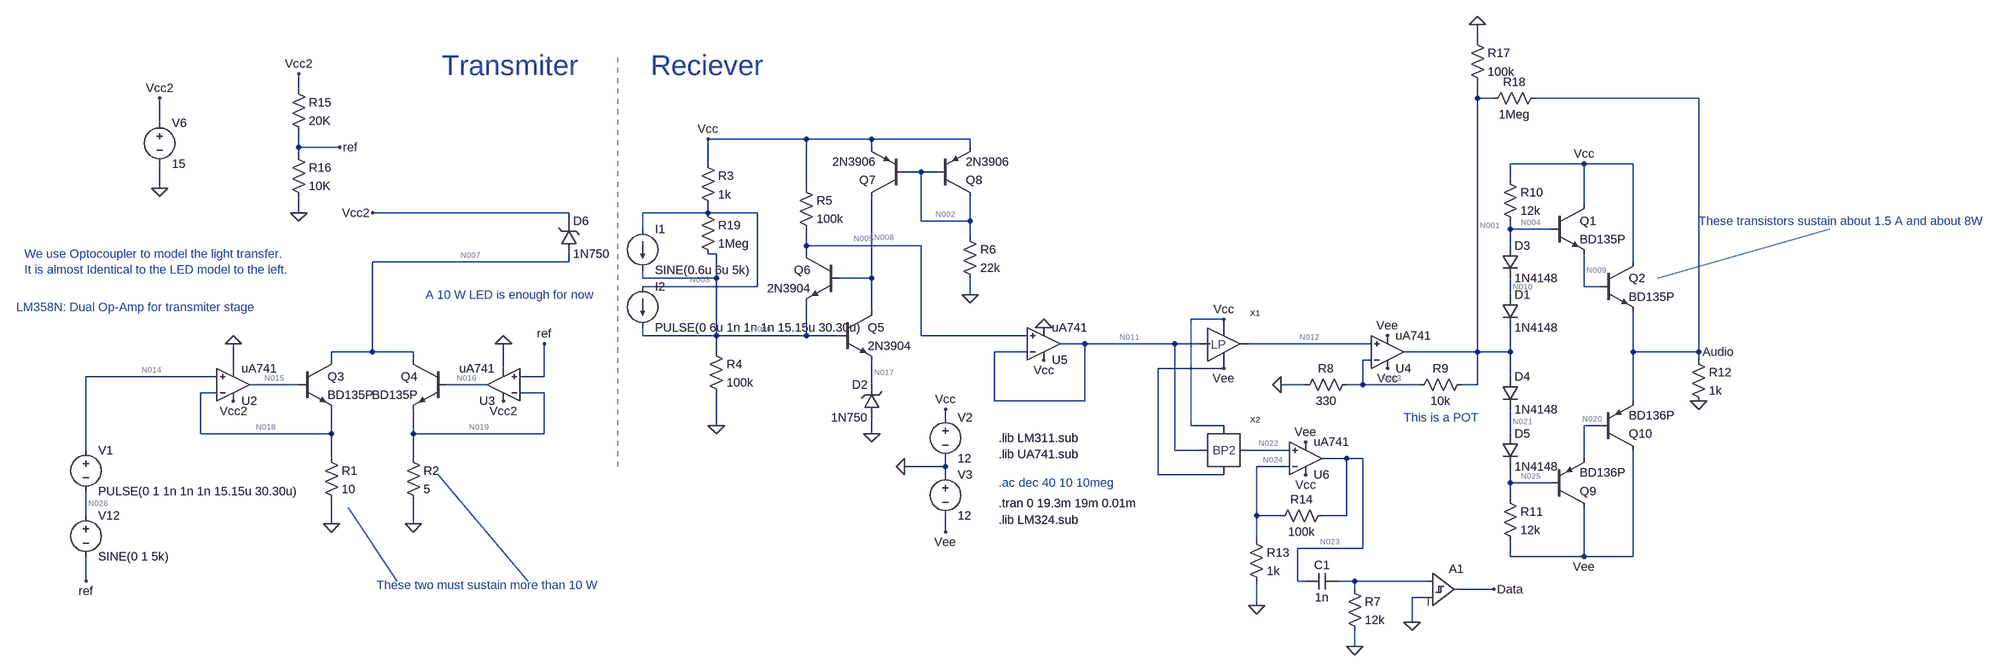
[diagram p0: schematic sim.asc]
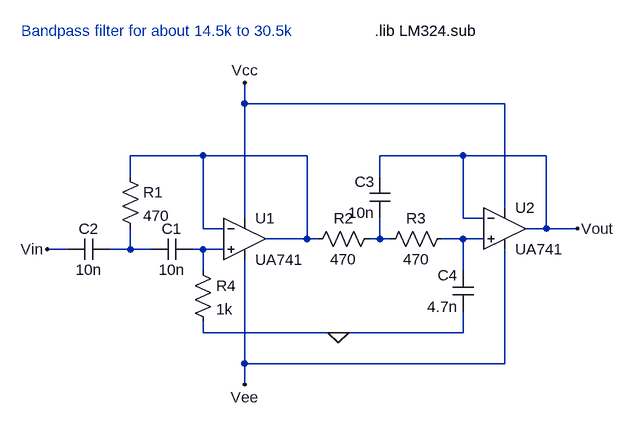
[diagram p1: sub-circuit bandpass2.asc]
sim.asc, the LTspice schematic file:
Version 4
SHEET 1 1732 1272
WIRE 208 -144 208 -176
WIRE -2096 -48 -2096 -80
WIRE 208 -32 208 -64
WIRE 240 -32 208 -32
WIRE 640 -32 320 -32
WIRE -2368 16 -2368 -32
WIRE -1104 48 -1296 48
WIRE -976 48 -1104 48
WIRE -784 48 -976 48
WIRE -2096 64 -2096 32
WIRE -2016 64 -2096 64
WIRE -976 64 -976 48
WIRE -784 64 -784 48
WIRE -2096 80 -2096 64
WIRE -1296 96 -1296 48
WIRE 416 96 272 96
WIRE 512 96 416 96
WIRE -880 112 -912 112
WIRE -848 112 -880 112
WIRE 272 128 272 96
WIRE -2368 144 -2368 96
WIRE -1104 144 -1104 48
WIRE 416 176 416 96
WIRE -2096 192 -2096 160
WIRE -1568 192 -1952 192
WIRE -1296 192 -1296 176
WIRE -1296 192 -1424 192
WIRE -1200 192 -1296 192
WIRE -1568 208 -1568 192
WIRE -880 208 -880 112
WIRE -784 208 -784 160
WIRE -784 208 -880 208
WIRE -1424 224 -1424 192
WIRE 272 224 272 208
WIRE 352 224 272 224
WIRE -784 240 -784 208
WIRE -1104 256 -1104 224
WIRE -880 256 -1104 256
WIRE 272 256 272 224
WIRE -1280 272 -1296 272
WIRE -1104 272 -1104 256
WIRE -1568 288 -1568 272
WIRE -1568 288 -1952 288
WIRE 512 288 512 96
WIRE -1424 320 -1424 304
WIRE -1280 320 -1280 272
WIRE -1280 320 -1424 320
WIRE -976 320 -976 160
WIRE -976 320 -1040 320
WIRE -1200 336 -1200 192
WIRE -1200 336 -1424 336
WIRE 416 336 416 272
WIRE 448 336 416 336
WIRE -784 352 -784 320
WIRE 272 352 272 320
WIRE -976 384 -976 320
WIRE -288 400 -352 400
WIRE -1424 432 -1424 416
WIRE -1280 432 -1280 320
WIRE -1280 432 -1424 432
WIRE -1104 432 -1104 368
WIRE -1104 432 -1280 432
WIRE -1040 432 -1104 432
WIRE -880 432 -880 256
WIRE -672 432 -880 432
WIRE -560 448 -608 448
WIRE -384 448 -560 448
WIRE -336 448 -384 448
WIRE 0 448 -240 448
WIRE -1952 464 -1952 288
WIRE -1952 464 -2032 464
WIRE -1872 464 -1952 464
WIRE -1280 464 -1280 432
WIRE -672 464 -736 464
WIRE 208 464 208 -32
WIRE 208 464 64 464
WIRE 272 464 272 416
WIRE 272 464 208 464
WIRE 512 464 512 384
WIRE 640 464 640 -32
WIRE 640 464 512 464
WIRE -2032 480 -2032 464
WIRE -1872 480 -1872 464
WIRE 0 480 -16 480
WIRE 640 480 640 464
WIRE -2224 496 -2224 448
WIRE -1696 496 -1696 448
WIRE -288 496 -416 496
WIRE -2256 512 -2512 512
WIRE -1616 512 -1616 448
WIRE -1616 512 -1664 512
WIRE 272 512 272 464
WIRE -2096 528 -2192 528
WIRE -1728 528 -1808 528
WIRE -976 528 -976 480
WIRE -128 528 -176 528
WIRE -16 528 -16 480
WIRE -16 528 -48 528
WIRE 96 528 -16 528
WIRE 208 528 208 464
WIRE 208 528 176 528
WIRE -2256 544 -2288 544
WIRE -1616 544 -1664 544
WIRE -736 560 -736 464
WIRE -560 560 -560 448
WIRE -560 560 -736 560
WIRE 512 560 512 464
WIRE -832 592 -832 576
WIRE -1280 608 -1280 544
WIRE -352 608 -352 400
WIRE -288 608 -352 608
WIRE 448 608 416 608
WIRE -2288 624 -2288 544
WIRE -2032 624 -2032 576
WIRE -2032 624 -2288 624
WIRE -1872 624 -1872 576
WIRE -1616 624 -1616 544
WIRE -1616 624 -1872 624
WIRE -976 624 -976 592
WIRE 272 624 272 576
WIRE -2512 656 -2512 512
WIRE -384 656 -384 448
WIRE -336 656 -384 656
WIRE -160 656 -240 656
WIRE -2032 672 -2032 624
WIRE -1872 672 -1872 624
WIRE -48 672 -96 672
WIRE -16 672 -48 672
WIRE 416 672 416 608
WIRE -832 688 -832 672
WIRE -832 688 -912 688
WIRE -160 688 -224 688
WIRE -832 704 -832 688
WIRE -416 704 -416 496
WIRE -288 704 -416 704
WIRE 272 720 272 688
WIRE 352 720 272 720
WIRE 272 752 272 720
WIRE -2512 784 -2512 736
WIRE -224 784 -224 688
WIRE -176 784 -224 784
WIRE -48 784 -48 672
WIRE -48 784 -96 784
WIRE -2032 800 -2032 752
WIRE -1872 800 -1872 752
WIRE -832 816 -832 784
WIRE -224 832 -224 784
WIRE -16 848 -16 672
WIRE -16 848 -144 848
WIRE 272 864 272 832
WIRE 416 864 416 768
WIRE 416 864 272 864
WIRE 512 864 512 656
WIRE 512 864 416 864
WIRE -2512 912 -2512 864
WIRE -144 912 -144 848
WIRE -128 912 -144 912
WIRE -32 912 -64 912
WIRE 112 912 -32 912
WIRE -32 928 -32 912
WIRE 240 928 176 928
WIRE 112 944 80 944
WIRE -224 960 -224 912
WIRE 80 992 80 944
WIRE -32 1040 -32 1008
FLAG -912 688 0
FLAG -832 816 Vee
FLAG -832 576 Vcc
FLAG -2368 144 0
FLAG -2368 -32 Vcc2
FLAG -2032 800 0
FLAG -1872 800 0
FLAG -1616 448 ref
FLAG -2224 560 Vcc2
FLAG -1696 560 Vcc2
FLAG -1952 192 Vcc2
FLAG -1296 48 Vcc
FLAG -1280 608 0
FLAG -976 624 0
FLAG -784 352 0
FLAG -288 400 Vcc
FLAG -640 480 Vcc
FLAG -176 528 0
FLAG 32 496 Vcc
FLAG 32 432 Vee
FLAG 416 864 Vee
FLAG 416 96 Vcc
FLAG 640 560 0
FLAG -32 1040 0
FLAG -2224 448 0
FLAG -1696 448 0
FLAG -640 416 0
FLAG -288 496 Vee
FLAG -2512 912 ref
FLAG -128 704 Vcc
FLAG -128 640 Vee
FLAG -224 960 0
FLAG -2096 192 0
FLAG -2096 -80 Vcc2
FLAG -2016 64 ref
FLAG 640 464 Audio
FLAG 208 -176 0
FLAG 80 992 0
FLAG 240 928 Data
SYMBOL voltage -832 576 R0
WINDOW 123 0 0 Left 0
WINDOW 39 0 0 Left 0
SYMATTR InstName V2
SYMATTR Value 12
SYMBOL voltage -832 688 R0
WINDOW 123 0 0 Left 0
WINDOW 39 0 0 Left 0
SYMATTR InstName V3
SYMATTR Value 12
SYMBOL voltage -2368 0 R0
WINDOW 123 0 0 Left 0
WINDOW 39 0 0 Left 0
SYMATTR InstName V6
SYMATTR Value 15
SYMBOL npn -2096 480 R0
SYMATTR InstName Q3
SYMATTR Value BD135P
SYMBOL npn -1808 480 M0
SYMATTR InstName Q4
SYMATTR Value BD135P
SYMBOL res -2048 656 R0
SYMATTR InstName R1
SYMATTR Value 10
SYMBOL res -1888 656 R0
SYMATTR InstName R2
SYMATTR Value 5
SYMBOL voltage -2512 640 R0
WINDOW 123 0 0 Left 0
WINDOW 39 0 0 Left 0
SYMATTR InstName V1
SYMATTR Value PULSE(0 1 1n 1n 1n 15.15u 30.30u)
SYMBOL voltage -2512 768 R0
WINDOW 123 0 0 Left 0
WINDOW 39 0 0 Left 0
SYMATTR InstName V12
SYMATTR Value SINE(0 1 5k)
SYMBOL res -1312 80 R0
SYMATTR InstName R3
SYMATTR Value 1k
SYMBOL res -1296 448 R0
SYMATTR InstName R4
SYMATTR Value 100k
SYMBOL npn -1040 384 R0
SYMATTR InstName Q5
SYMATTR Value 2N3904
SYMBOL npn -1040 272 M0
SYMATTR InstName Q6
SYMATTR Value 2N3904
SYMBOL zener -960 592 R180
WINDOW 0 24 64 Left 2
WINDOW 3 24 0 Left 2
SYMATTR InstName D2
SYMATTR Value 1N750
SYMATTR Description Diode
SYMATTR Type diode
SYMBOL res -1120 128 R0
SYMATTR InstName R5
SYMATTR Value 100k
SYMBOL pnp -912 160 R180
SYMATTR InstName Q7
SYMATTR Value 2N3906
SYMBOL pnp -848 160 M180
SYMATTR InstName Q8
SYMATTR Value 2N3906
SYMBOL res -800 224 R0
SYMATTR InstName R6
SYMATTR Value 22k
SYMBOL BandPass2 -288 656 R0
SYMATTR InstName X2
SYMBOL res -48 912 R0
SYMATTR InstName R7
SYMATTR Value 12k
SYMBOL cap -64 896 R90
WINDOW 0 0 32 VBottom 2
WINDOW 3 32 32 VTop 2
SYMATTR InstName C1
SYMATTR Value 1n
SYMBOL Opamps\\uA741 32 528 M180
SYMATTR InstName U4
SYMBOL res -32 512 R90
WINDOW 0 0 56 VBottom 2
WINDOW 3 32 56 VTop 2
SYMATTR InstName R8
SYMATTR Value 330
SYMBOL res 192 512 R90
WINDOW 0 0 56 VBottom 2
WINDOW 3 32 56 VTop 2
SYMATTR InstName R9
SYMATTR Value 10k
SYMBOL diode 256 352 R0
SYMATTR InstName D1
SYMATTR Value 1N4148
SYMBOL diode 256 256 R0
SYMATTR InstName D3
SYMATTR Value 1N4148
SYMBOL diode 256 512 R0
SYMATTR InstName D4
SYMATTR Value 1N4148
SYMBOL diode 256 624 R0
SYMATTR InstName D5
SYMATTR Value 1N4148
SYMBOL res 256 112 R0
SYMATTR InstName R10
SYMATTR Value 12k
SYMBOL res 256 736 R0
SYMATTR InstName R11
SYMATTR Value 12k
SYMBOL npn 352 176 R0
SYMATTR InstName Q1
SYMATTR Value BD135P
SYMBOL npn 448 288 R0
SYMATTR InstName Q2
SYMATTR Value BD135P
SYMBOL pnp 352 768 M180
SYMATTR InstName Q9
SYMATTR Value BD136P
SYMBOL pnp 448 656 M180
SYMATTR InstName Q10
SYMATTR Value BD136P
SYMBOL res 624 464 R0
SYMATTR InstName R12
SYMATTR Value 1k
SYMBOL lowPass -288 448 R0
SYMATTR InstName X1
SYMBOL Opamps\\uA741 -2224 592 M180
SYMATTR InstName U2
SYMBOL Opamps\\uA741 -1696 592 R180
SYMATTR InstName U3
SYMBOL Opamps\\uA741 -640 512 M180
SYMATTR InstName U5
SYMBOL Opamps\\uA741 -128 736 M180
SYMATTR InstName U6
SYMBOL res -240 816 R0
SYMATTR InstName R13
SYMATTR Value 1k
SYMBOL res -80 768 R90
WINDOW 0 0 56 VBottom 2
WINDOW 3 32 56 VTop 2
SYMATTR InstName R14
SYMATTR Value 100k
SYMBOL res -2112 -64 R0
SYMATTR InstName R15
SYMATTR Value 20K
SYMBOL res -2112 64 R0
SYMATTR InstName R16
SYMATTR Value 10K
SYMBOL res 192 -160 R0
SYMATTR InstName R17
SYMATTR Value 100k
SYMBOL res 336 -48 R90
WINDOW 0 0 56 VBottom 2
WINDOW 3 32 56 VTop 2
SYMATTR InstName R18
SYMATTR Value 1Meg
SYMBOL Digital\\diffschmtbuf 112 864 R0
SYMATTR InstName A1
SYMBOL zener -1584 272 M180
WINDOW 0 24 64 Left 2
WINDOW 3 24 0 Left 2
SYMATTR InstName D6
SYMATTR Value 1N750
SYMATTR Description Diode
SYMATTR Type diode
SYMBOL res -1312 176 R0
SYMATTR InstName R19
SYMATTR Value 1Meg
SYMBOL current -1424 224 R0
WINDOW 123 0 0 Left 0
WINDOW 39 0 0 Left 0
SYMATTR InstName I1
SYMATTR Value SINE(0.6u 6u 5k)
SYMBOL current -1424 336 R0
WINDOW 123 0 0 Left 0
WINDOW 39 0 0 Left 0
SYMATTR InstName I2
SYMATTR Value PULSE(0 6u 1n 1n 1n 15.15u 30.30u)
TEXT -728 664 Left 2 !.lib UA741.sub
TEXT -728 720 Left 2 ;.ac dec 40 10 10meg
TEXT -728 760 Left 2 !.tran 0 19.3m 19m 0.01m
TEXT -2632 272 Left 2 ;We use Optocoupler to model the light transfer.\nIt is almost Identical to the LED model to the left.
TEXT -728 632 Left 2 !.lib LM311.sub
TEXT 64 592 Left 2 ;This is a POT
TEXT -1944 920 Left 2 ;These two must sustain more than 10 W
TEXT 640 208 Left 2 ;These transistors sustain about 1.5 A and about 8W
TEXT -1848 352 Left 2 ;A 10 W LED is enough for now
TEXT -1408 -96 Left 5 ;Reciever
TEXT -1816 -96 Left 5 ;Transmiter
TEXT -2648 376 Left 2 ;LM358N: Dual Op-Amp for transmiter stage
TEXT -728 792 Left 2 !.lib LM324.sub
LINE Normal -1824 704 -1648 912
LINE Normal -2000 768 -1904 912
LINE Normal 560 320 896 224
LINE Normal -1472 688 -1472 -112 1

bandpass2.asc, the sub-circuit schematic file:
Version 4
SHEET 1 880 680
WIRE 96 -64 96 -96
WIRE 496 -64 96 -64
WIRE 32 16 -80 16
WIRE 192 16 32 16
WIRE 432 16 304 16
WIRE 560 16 432 16
WIRE -80 48 -80 16
WIRE 304 48 304 16
WIRE 496 96 496 -64
WIRE 96 112 96 -64
WIRE 432 112 432 16
WIRE 464 112 432 112
WIRE 32 128 32 16
WIRE 64 128 32 128
WIRE 560 128 560 16
WIRE 560 128 528 128
WIRE 608 128 560 128
WIRE 192 144 192 16
WIRE 192 144 128 144
WIRE 208 144 192 144
WIRE 304 144 304 112
WIRE 304 144 288 144
WIRE 320 144 304 144
WIRE 432 144 400 144
WIRE 464 144 432 144
WIRE -176 160 -208 160
WIRE -80 160 -80 128
WIRE -80 160 -112 160
WIRE -48 160 -80 160
WIRE 32 160 16 160
WIRE 64 160 32 160
WIRE 32 192 32 160
WIRE 432 192 432 144
WIRE 32 288 32 272
WIRE 240 288 32 288
WIRE 432 288 432 256
WIRE 432 288 240 288
WIRE 96 336 96 176
WIRE 496 336 496 160
WIRE 496 336 96 336
WIRE 96 368 96 336
FLAG 240 288 0
FLAG -208 160 Vin
FLAG 608 128 Vout
FLAG 96 -96 Vcc
FLAG 96 368 Vee
SYMBOL cap 16 144 R90
WINDOW 0 0 32 VBottom 2
WINDOW 3 32 32 VTop 2
SYMATTR InstName C1
SYMATTR Value 10n
SYMBOL cap -112 144 R90
WINDOW 0 0 32 VBottom 2
WINDOW 3 32 32 VTop 2
SYMATTR InstName C2
SYMATTR Value 10n
SYMBOL res -96 32 R0
SYMATTR InstName R1
SYMATTR Value 470
SYMBOL res 304 128 R90
WINDOW 0 0 56 VBottom 2
WINDOW 3 32 56 VTop 2
SYMATTR InstName R2
SYMATTR Value 470
SYMBOL res 416 128 R90
WINDOW 0 0 56 VBottom 2
WINDOW 3 32 56 VTop 2
SYMATTR InstName R3
SYMATTR Value 470
SYMBOL cap 320 112 R180
WINDOW 0 24 56 Left 2
WINDOW 3 24 8 Left 2
SYMATTR InstName C3
SYMATTR Value 10n
SYMBOL cap 448 256 R180
WINDOW 0 24 56 Left 2
WINDOW 3 24 8 Left 2
SYMATTR InstName C4
SYMATTR Value 4.7n
SYMBOL res 16 176 R0
SYMATTR InstName R4
SYMATTR Value 1k
SYMBOL Opamps\\LM324 96 80 R0
SYMATTR InstName U1
SYMATTR Value UA741
SYMBOL Opamps\\LM324 496 64 R0
SYMATTR InstName U2
SYMATTR Value UA741
TEXT -248 -176 Left 2 ;Bandpass filter for about 14.5k to 30.5k
TEXT 296 -176 Left 2 !.lib LM324.sub

The netlist it stands for:
* sim.asc
V2 Vcc 0 12
V3 0 Vee 12
V6 Vcc2 0 15
Q3 N007 N015 N018 0 BD135P
Q4 N007 N016 N019 0 BD135P
R1 N018 0 10
R2 N019 0 5
V1 N014 N026 PULSE(0 1 1n 1n 1n 15.15u 30.30u)
V12 N026 ref SINE(0 1 5k)
R3 Vcc N003 1k
R4 N006 0 100k
Q5 N008 N006 N017 0 2N3904
Q6 N005 N008 N006 0 2N3904
D2 0 N017 1N750
R5 Vcc N005 100k
Q7 N008 N002 Vcc 0 2N3906
Q8 N002 N002 Vcc 0 2N3906
R6 N002 0 22k
XX2 N011 N022 Vcc Vee bandpass2
R7 N027 0 12k
C1 N027 N023 1n
XU4 N012 N013 Vcc Vee N001 uA741  ; pins In+ In- V+ V- OUT
R8 N013 0 330
R9 N001 N013 10k
D1 N010 N001 1N4148
D3 N004 N010 1N4148
D4 N001 N021 1N4148
D5 N021 N025 1N4148
R10 Vcc N004 12k
R11 N025 Vee 12k
Q1 Vcc N004 N009 0 BD135P
Q2 Vcc N009 Audio 0 BD135P
Q9 Vee N025 N020 0 BD136P
Q10 Vee N020 Audio 0 BD136P
R12 Audio 0 1k
XX1 N011 N012 Vcc Vee lowPass  ; pins Vin Vout Vcc Vee
XU2 N014 N018 Vcc2 0 N015 uA741  ; pins In+ In- V+ V- OUT
XU3 ref N019 Vcc2 0 N016 uA741  ; pins In+ In- V+ V- OUT
XU5 N005 N011 Vcc 0 N011 uA741  ; pins In+ In- V+ V- OUT
XU6 N022 N024 Vcc Vee N023 uA741  ; pins In+ In- V+ V- OUT
R13 N024 0 1k
R14 N023 N024 100k
R15 Vcc2 ref 20K
R16 ref 0 10K
R17 0 N001 100k
R18 Audio N001 1Meg
A1 N027 0 0 0 0 0 Data 0 SCHMITT
D6 N007 Vcc2 1N750
R19 N003 N006 1Meg
I1 N003 N006 SINE(0.6u 6u 5k)
I2 N003 N006 PULSE(0 6u 1n 1n 1n 15.15u 30.30u)

* block symbol definitions
.subckt bandpass2 Vin Vout Vcc Vee
C1 N005 N004 10n
C2 N004 Vin 10n
R1 N001 N004 470
R2 N002 N001 470
R3 N003 N002 470
C3 N002 Vout 10n
C4 0 N003 4.7n
R4 N005 0 1k
XU1 N005 N001 Vcc Vee N001 UA741  ; pins In+ In- V+ V- OUT
XU2 N003 Vout Vcc Vee Vout UA741  ; pins In+ In- V+ V- OUT
* Bandpass filter for about 14.5k to 30.5k
.lib LM324.sub
.ends bandpass2

.model D D
.lib standard.dio
.model NPN NPN
.model PNP PNP
.lib standard.bjt
.lib UA741.sub
* .ac dec 40 10 10meg
.tran 0 19.3m 19m 0.01m
* We use Optocoupler to model the light transfer.
* It is almost Identical to the LED model to the left.
.lib LM311.sub
* This is a POT
* These two must sustain more than 10 W
* These transistors sustain about 1.5 A and about 8W
* A 10 W LED is enough for now
* Reciever
* Transmiter
* LM358N: Dual Op-Amp for transmiter stage
.lib LM324.sub
.backanno
.end

* Results of the author's LTspice run, read from the files saved beside the schematic
* Operating Point, zero values left out:
*   V(vcc) = 12 V
*   V(vee) = -12 V
*   V(vcc2) = 15 V
*   V(n007) = 9.741 V
*   V(n015) = 5.858 V
*   V(n018) = 4.999 V
*   V(n016) = 5.967 V
*   V(n019) = 4.999 V
*   V(n014) = 4.999 V
*   V(n026) = 4.999 V
*   V(ref) = 4.999 V
*   V(n003) = 11.99 V
*   V(n006) = 4.841 V
*   V(n008) = 5.414 V
*   V(n017) = 4.202 V
*   V(n005) = 7.76 V
*   V(n002) = 11.36 V
*   V(n011) = 7.76 V
*   V(n022) = -132.3 µV
*   V(n023) = -4.256 mV
*   V(n001) = 70.99 mV
*   V(n013) = 2.242 mV
*   V(n012) = 2.232 mV
*   V(n010) = 650.8 mV
*   V(n004) = 1.231 V
*   V(n021) = -509.4 mV
*   V(n025) = -1.09 V
*   V(n009) = 705.4 mV
*   V(audio) = 54.8 mV
*   V(n020) = -588.5 mV
*   V(n024) = -121.1 µV
*   Ic(Q10) = -5.241 mA
*   Ib(Q10) = -22.57 µA
*   Ie(Q10) = 5.263 mA
*   Ic(Q9) = -22.46 µA
*   Ib(Q9) = -104.3 nA
*   Ie(Q9) = 22.57 µA
*   Ic(Q8) = -511.3 µA
*   Ib(Q8) = -2.56 µA
*   Ie(Q8) = 513.9 µA
*   Ic(Q7) = -541.7 µA
*   Ib(Q7) = -2.56 µA
*   Ie(Q7) = 544.2 µA
*   Ic(Q6) = 42.32 µA
*   Ib(Q6) = 137.9 nA
*   Ie(Q6) = -42.46 µA
*   Ic(Q5) = 541.6 µA
*   Ib(Q5) = 1.797 µA
*   Ie(Q5) = -543.3 µA
*   Ic(Q2) = 5.277 mA
*   Ib(Q2) = 40.96 µA
*   Ie(Q2) = -5.318 mA
*   Ic(Q1) = 40.64 µA
*   Ib(Q1) = 318.5 nA
*   Ie(Q1) = -40.96 µA
*   Ic(Q4) = 987.1 mA
*   Ib(Q4) = 12.73 mA
*   Ie(Q4) = -999.8 mA
*   Ic(Q3) = 494.7 mA
*   Ib(Q3) = 5.167 mA
*   Ie(Q3) = -499.9 mA
*   I(D5) = 909.1 µA
*   I(D4) = 909.1 µA
*   I(D3) = 897.1 µA
*   I(D1) = 897.1 µA
*   I(D6) = -1.482 A
*   I(D2) = -543.3 µA
*   I(I1) = 600 nA
*   I(R19) = 7.151 µA
*   I(R18) = -16.19 nA
*   I(R17) = -709.9 nA
*   I(R16) = 499.9 µA
*   I(R15) = 500.1 µA
*   I(R14) = -41.35 nA
*   I(R13) = -121.1 nA
*   I(R12) = 54.8 µA
*   I(R11) = 909.2 µA
*   I(R10) = 897.5 µA
*   I(R9) = 6.875 µA
*   I(R8) = 6.795 µA
*   I(R6) = 516.5 µA
*   I(R5) = 42.4 µA
*   I(R4) = 48.41 µA
*   I(R3) = 7.751 µA
*   I(R2) = 999.8 mA
*   I(R1) = 499.9 mA
*   I(V12) = -78.69 nA
*   I(V1) = -78.69 nA
*   I(V6) = -1.484 A
*   I(V3) = -14.18 mA
*   I(V2) = -16.01 mA
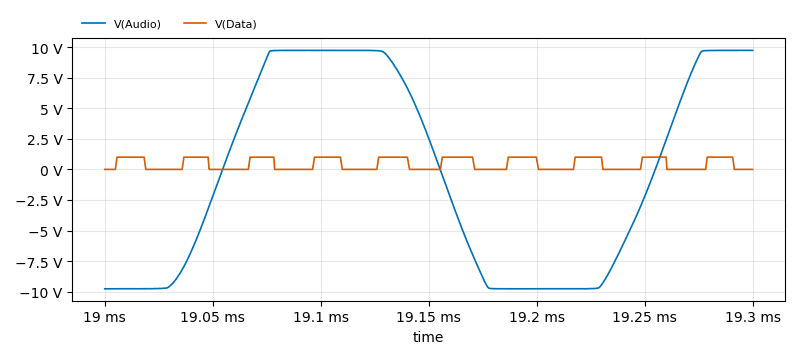
[diagram p2: Transient Analysis of sim.asc, plotted from the saved traces]
* Transient Analysis, 1 run:
*   V(Audio): min -9.77 V, max 9.74 V, average -251.2 mV, rms 8.18 V, last 9.74 V
*   V(Data): min 0 V, max 1 V, average 432.7 mV, rms 657.8 mV, last 0 V